# EAGLE design spbka (EAGLE 9.6.2)
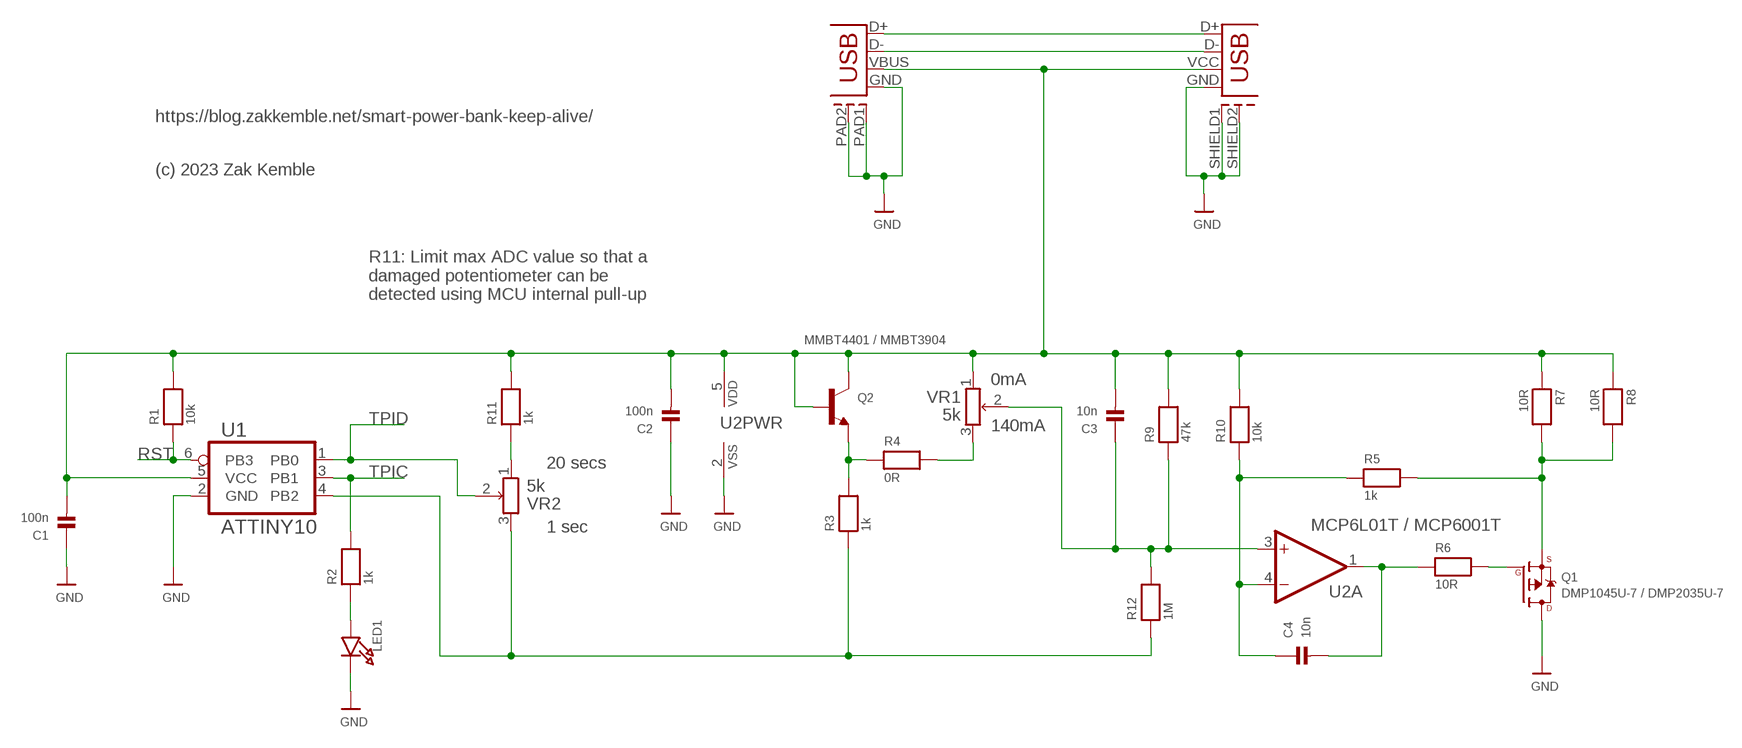
[diagram p0: schematic, sheet 1]

## Parts
C1  100n  CAP_CERAMIC0402_XSMALL  [0402_XSMALL]
C2  100n  CAP_CERAMIC0402_XSMALL  [0402_XSMALL]
C3  10n  CAP_CERAMIC0402_XSMALL  [0402_XSMALL]
C4  10n  CAP_CERAMIC0402_XSMALL  [0402_XSMALL]
LED1  LED0603_NOOUTLINE  [CHIPLED_0603_NOOUTLINE]
Q1  DMP1045U-7 / DMP2035U-7  MOSFET-PSOT-23-WIDE  [SOT-23-WIDE]
Q2  MMBT4401 / MMBT3904  TRANSISTOR_NPN  [SOT23-R]
R1  10k  RESISTOR0402_XSMALL  [0402_XSMALL]
R2  1k  RESISTOR0402_XSMALL  [0402_XSMALL]
R3  1k  RESISTOR0402_XSMALL  [0402_XSMALL]
R4  0R  RESISTOR0402_XSMALL  [0402_XSMALL]
R5  1k  RESISTOR0402_XSMALL  [0402_XSMALL]
R6  10R  RESISTOR0402_XSMALL  [0402_XSMALL]
R7  10R  RESISTOR0402_XSMALL  [0402_XSMALL]
R8  10R  RESISTOR0402_XSMALL  [0402_XSMALL]
R9  47k  RESISTOR0402_XSMALL  [0402_XSMALL]
R10  10k  RESISTOR0402_XSMALL  [0402_XSMALL]
R11  1k  RESISTOR0402_XSMALL  [0402_XSMALL]
R12  1M  RESISTOR0402_XSMALL  [0402_XSMALL]
U1  ATTINY10  ATTINY10SM_PAD  [SOT23-6_SM_PAD]
U2  MCP6L01T / MCP6001T  OPAMP_SINGLECONFIG1_SMPAD  [SOT23-5_SM_PAD]
USB1  USB-TYPE-AHORZ  [USB-TYPE-A]
USB2  USB-PLUG  [USB-TYPE-A-PLUG-SLOT]
VR1  5k  POTENTIOMETERBOURNS3MM  [TRIMPOT_BOURNS3MM]
VR2  5k  POTENTIOMETERBOURNS3MM  [TRIMPOT_BOURNS3MM]

## Nets
GND: C1.1 C2.1 LED1.C Q1.3(D) U1.2(GND) U2.2(PWR:VSS) USB1.GND USB1.SHIELD1(SHEILD1) USB1.SHIELD2(SHEILD2) USB2.GND USB2.PAD1(SHEILD1) USB2.PAD2(SHEILD2)
N$1: Q2.2(E) R3.2 R4.1
N$2: Q1.2(S) R5.2 R7.2 R8.2
N$3: C4.2 R6.1 U2.1(A:OUT)
N$4: LED1.A R2.1
N$5: USB1.D+ USB2.D+
N$6: USB1.D- USB2.D-
N$7: R3.1 R12.1 U1.4(PB2) VR2.3(1E)
N$8: C4.1 R5.1 R10.1 U2.4(A:-IN)
N$9: R4.2 VR1.3(1E)
N$10: Q1.1(G) R6.2
N$11: C3.1 R9.1 R12.2 U2.3(A:+IN) VR1.2(1S)
N$12: R11.1 VR2.1(1A)
RST: R1.1 U1.6(PB3)
TPIC: R2.2 U1.3(PB1)
TPID: U1.1(PB0) VR2.2(1S)
VBUS: C1.2 C2.2 C3.2 Q2.1(B) Q2.3(C) R1.2 R7.1 R8.1 R9.2 R10.2 R11.2 U1.5(VCC) U2.5(PWR:VDD) USB1.VCC(VBUS) USB2.VBUS VR1.1(1A)

## Notes on the sheet
- https://blog.zakkemble.net/smart-power-bank-keep-alive/
- (c) 2023 Zak Kemble
- R11: Limit max ADC value so that a
  damaged potentiometer can be
  detected using MCU internal pull-up
- 0mA
- 140mA
- 20 secs
- 1 sec

## Library data of the parts
C1-C4 = zak:CAP_CERAMIC
LED1 = microbuilder:LED: LED 0603 - 0603 Surface Mount Package 2mA: Green LED - Low Power (3.9mcd, 2ma, 1.7Vf) - Digikey: 475-2709-2-ND Orange LED - Low Power (9.8mcd, 2ma, 1.8Vf) - Digikey: 475-1194-2-ND Red LED - Low Power (5mcd, 2ma, 1.8Vf) - Digikey: 475-1195-2-ND Yellow LED - Low Power (7mcd, 2ma, 1.8Vf) - Digikey: 475-1196-2-ND 5mA: Blue LED - Low Power (17mcd, 5ma, 2.9Vf) - Digikey: LNJ937W8CRACT-ND 0805 - 0805 Surface Mount Package 2mA: Red LED (8.8mcd, 2mA, 1.8Vf, Clear) - Low Power [Digikey: 475-2510-1-ND] Green LED (5mcd, 2mA, 1.8Vf, Clear) - Low Power [Digikey: 475-2730-1-ND] Yellow LED (11.3mcd, 2mA, 1.8Vf, Clear) - Low Power [Digikey: 475-2555-1-ND] 20mA: Red LED (104mcd, 20mA, Diffused) - LS R976 [Digikey: 475-1278-6-ND] Red LED (12mcd, 20mA, 2.0Vf, Clear) - APT2012EC [Digikey: 754-1128-1-ND] Green LED (15mcd, 20mA, 2.2Vf, Clear) - APT2012GC [Digikey: 754-1131-1-ND] Orange LED (160mcd, 20mA, 2.1Vf, Clear) - APT2012SECK [Digikey: 754-1130-1-ND] 1206 - 1206 Surface Mount Package Green LED (26mcd, 20mA, Diffused) - LG N971 [Digikey: 475-1407-6-ND] Red LED (15mcd, 20mA, Diffused) - LH N974 [Digikey: 475-1416-6-ND]
Q1 = zak:MOSFET-P
Q2 = microbuilder:TRANSISTOR_NPN: NPN Transistor Transistor (NPN) 500mA 45V - BC817 [Digikey: 568-1631-1-ND] Transistor (NPN) 500mA 45V - BC817,215 [Mouser: 771-BC817-T/R] SOT23-R - SOT23 footprint optimised for use with solder paste and reflow ovens. SOT23-W - SOT23 footprint optimised for hand-soldering (larger pads).
R1-R12 = zak:RESISTOR
U1 = zak:ATTINY10
U2 = zak:OPAMP_SINGLE
USB1 = zak:USB-TYPE-A
USB2 = zak:USB-PLUG
VR1 VR2 = zak:POTENTIOMETER

## Board
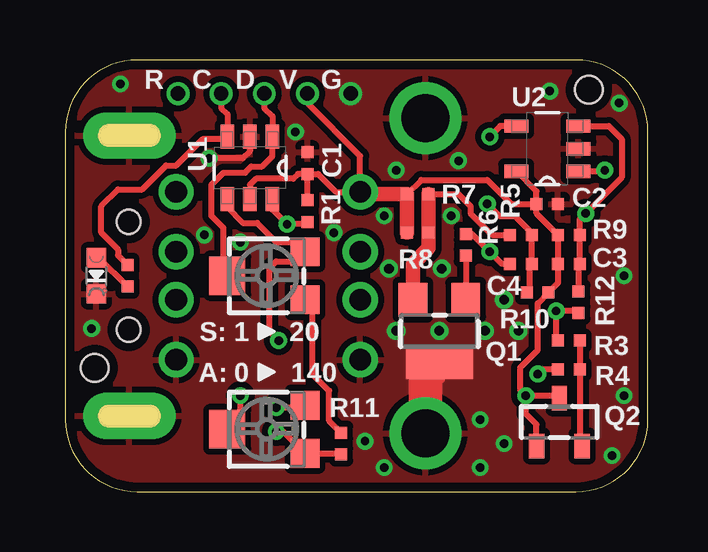
[diagram p1: board, top side]
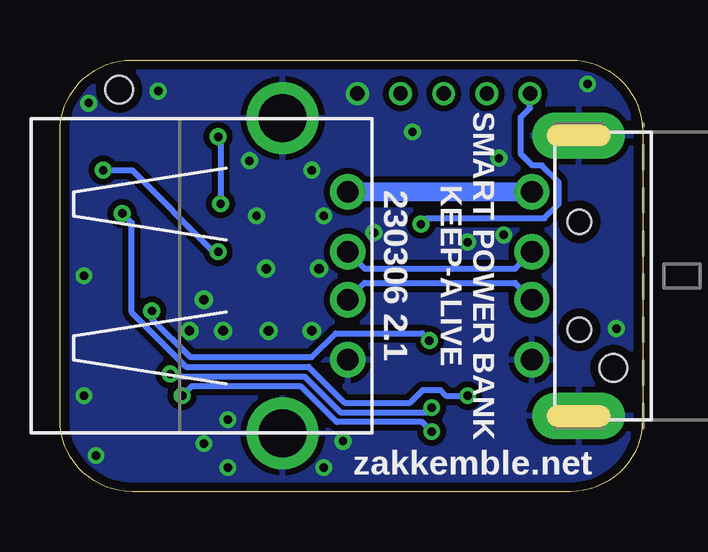
[diagram p2: board, bottom side, seen from below]

Size 24.3 x 18 mm. Coordinates in mm from the lower left corner, seen from the top.
Outline: 0,15 0,3 arc90 3,0 21.3,0 arc90 24.3,3 24.3,15 arc90 21.3,18 3,18 arc90 0,15
Copper layers (1*16): Top 0.0356mm / dielectric 1.5011mm / Bottom 0.0356mm
Design rules "LaenPCBOrder *": minimum track width 6mil, minimum drill 13mil, track to track 6mil, track to pad 6mil, pad to pad 6mil, via to via 6mil, smd to smd 6mil, copper to edge 15mil, drill to drill 6mil, minimum pad ring 11mil, minimum via ring 7mil, stop-mask expansion 2.5mil, vias tented up to drill 20mil, thermal gap 10mil
Holes 1.15 mm at 1.22,5.15 21.83,16.77

### Footprints (pad centres in the part's own frame; a part is rotated, then mirrored left to right if it is on the bottom)
0402_XSMALL = smd 0.5 x 0.5: 1 -0.45,0; 2 0.45,0
CHIPLED_0603_NOOUTLINE = smd 0.8 x 0.8: A 0,-0.75; C 0,0.75
SOT-23-WIDE = smd 1.2 x 1.4: 1 -1.1,-1.3; 2 1.1,-1.3 | smd 2.8 x 1.4: 3 0,1.3
SOT23-R = smd 0.635 x 1.016: 1 -0.95,-1; 2 0.95,-1; 3 0,1
SOT23-6_SM_PAD = smd 1 x 0.56: 1 -1.295,0.94; 2 -1.295,0; 3 -1.295,-0.94; 4 1.295,-0.94; 5 1.295,0; 6 1.295,0.94
SOT23-5_SM_PAD = smd 1 x 0.56: 1 -1.295,0.94; 2 -1.295,0; 3 -1.295,-0.94; 4 1.295,-0.94; 5 1.295,0.94
USB-TYPE-A = drill 0.9: D+ 1,0; D- -1,0; GND 3.5,0; VCC -3.5,0 | drill 2: SHIELD1 -6.57,-2.71; SHIELD2 6.57,-2.71
USB-TYPE-A-PLUG-SLOT = drill 0.9: D+ -1,10.325; D- 1,10.325; GND -3.5,10.325; VBUS 3.5,10.325 | drill 0.9 pad 1.93 long: PAD1 -5.85,8.375; PAD2 5.85,8.375 | hole 1: -2.25,8.345; 2.25,8.345
TRIMPOT_BOURNS3MM = smd 1.2 x 1.2: 1 -1,-1.6; 3 1,-1.6 | smd 1.6 x 1.5: 2 0,1.65

### Placement (x,y rotation side)
C1  10.1,13.7 270 top
C2  20.1,12 180 top
C3  21,9.5 180 top
C4  19,9.5 180 top
LED1  1.3,9 180 top
Q1  15.6,6.7 180 top
Q2  20.6,2.9 0 top
R1  10.1,11.7 90 top
R2  2.6,9 90 top
R3  21,6.3 0 top
R4  21,5.1 180 top
R5  19,10.7 180 top
R6  16.7,10.3 270 top
R7  14.7,12.4 0 top
R8  14.7,10.8 0 top
R9  21,10.7 180 top
R10  19.7,8.3 0 top
R11  11.5,2 270 top
R12  21.4,7.9 90 top
U1  7.7,13.5 270 top
U2  20.1,14.3 180 top
USB1  12.3,9 270 bottom
USB2  -5.7,9 90 bottom
VR1  8.4,2.6 90 top
VR2  8.4,9 90 top

### Tracks (layer width: path | path; a pad name or v marks a point on that pad's centre or on a via)
GND  (via drill 0.35, 0.4, 0.6)
  Top 0.25: U1.2 7.7,14.2 7.4,13.9 v6,13.9
  Top 1.4: USB1.SHIELD2 15.01,4.81 Q1.3
  other vias: 11.9,16.6 18.3,8 18.9,6.7 15.6,6.7 13.5,9.3 15.7,9.3 17.5,6.7 13.8,6.7 17.3,3 18.3,2 17.3,1 13.3,1 12.5,2.1 13.3,11.5 16.1,11.5 13.8,13.4 7.3,10.4 11.2,10.8 23.1,16.2 20.2,16.7 16.4,13.8 9.6,15 1.1,6.8 2.3,17 22.8,1.5 5.8,10.7 23.3,4 23.3,9
  pour Top (isolate 0.25, rank 6): 0,0 0,18 24.3,18 24.3,0
  pour Bottom (isolate 0.25, rank 6): 0,0 0,18 24.3,18 24.3,0
  pour Top (isolate 0.25, rank 5, no thermals): 17.3,6.4 17.3,4.4 13.9,4.4 13.9,6.4
N$1
  Top 0.25: R3.2 R4.1 21.45,2 Q2.2
N$2
  Top 0.25: R5.2 17.8,10.7 16.9,11.6 16.9,11.9 16.4,12.4 R7.2
  Top 0.6: Q1.2 14.5,9.5 15.15,10.15 R8.2 R7.2
N$3  (via drill 0.35)
  Top 0.25: v22.5,13.4 22.46,13.36 U2.1 | R6.1 16.95,10.75 v17.7,10 18.2,9.5 C4.2
  Bottom 0.25: v22.5,13.4 21.3,13.4 17.9,10 v17.7,10
N$4
  Top 0.25: R2.1 1.4,9.75 LED1.A
N$5
  Bottom 0.25: USB2.D+ 5.33,8.7 11.6,8.7 USB1.D+
N$6
  Bottom 0.25: USB1.D- 11.6,9.3 5.33,9.3 USB2.D-
N$7  (via drill 0.35)
  Top 0.25: U1.4 6.76,11.84 7.4,11.2 8,11.2 8.8,10.4 9.5,10.4 9.9,10 VR2.3 9.6,9.6 8.8,9.6 8.5,9.3 8.5,6.7 v8.9,6.3 | R3.1 20.47,6.38 v20.47,7.53 21.32,7.53 R12.1
  Bottom 0.25: v20.47,7.53 20.47,7.21 18.87,5.6 13.8,5.6 12.8,6.6 9.2,6.6 v8.9,6.3
N$8  (via drill 0.35)
  Top 0.25: U2.4 18.14,15.24 v17.7,14.8 | R10.1 19.35,8.4 19.35,9.4 C4.1 R5.1 19.5,10.75 18.75,11.5 18.1,11.5 v17.6,12
  Bottom 0.25: v17.7,14.8 17.6,14.7 v17.6,12
N$9  (via drill 0.35)
  Top 0.25: VR1.3 9.9,3.5 v8.8,3.5 | R4.2 19.9,5.1 v19.7,4.9
  Bottom 0.25: v8.8,3.5 9,3.3 12.6,3.3 14.1,4.8 19.6,4.8 v19.7,4.9
N$10
  Top 0.25: Q1.1 16.3,8 16.7,8.4 R6.2
N$11  (via drill 0.35)
  Top 0.25: v7.3,4 7.3,3.15 VR1.2 | R12.2 21.4,9.45 C3.1 R9.1 21.45,11.35 v21.7,11.6 23.2,13.1 23.2,14.7 22.66,15.24 U2.3
  Bottom 0.25: v21.7,11.6 21.3,11.2 21.3,7.47 19.03,5.2 13.93,5.2 12.43,3.7 9.7,3.7 9.17,4.23 8.43,4.23 8.2,4 v7.3,4
N$12
  Top 0.25: R11.1 11,2.95 11,4.2 10.3,4.9 10.3,7.7 VR2.1
RST  (via drill 0.35, 0.6)
  Top 0.25: U1.6 8.64,11.76 v9.25,11.15 10,11.15 R1.1
  Bottom 0.25: v9.25,11.15 9,11.4 4.1,11.4 3.5,12 3.5,12.9 4.2,13.6 4.6,13.6 5.1,14.1 5.1,15.6 4.7,16 v4.7,16.6
TPIC  (via drill 0.6)
  Top 0.25: R2.2 2.2,9.85 2.2,10.1 1.5,10.8 1.5,11.9 2.2,12.6 3.2,12.6 4.2,13.6 4.63,13.6 5.73,14.7 6.66,14.7 U1.3 6.76,15.74 6.5,16 v6.5,16.6
TPID  (via drill 0.6)
  Top 0.25: VR2.2 6.6,9 6.6,11 6.1,11.5 6.1,12.8 6.6,13.3 7.5,13.3 7.75,13.55 8.2,13.55 8.64,13.99 U1.1 8.64,15.66 8.3,16 v8.3,16.6
VBUS  (via drill 0.35, 0.6)
  Top 0.25: v8.8,2.5 9.1,2.5 VR1.1 11.45,1.6 R11.2 | C2.2 19.65,12.52 U2.5 | C2.2 18.6,12 17.6,13 14.85,13 R7.1 | C2.2 19.65,11.6 R9.2 C3.2 20.55,8.7 R10.2 19.7,7.85 19.7,5.9 18.97,5.17 18.97,4.24 v19.2,4.01 v19.2,4 | Q2.3 20.5,4 v19.2,4 | Q2.1 19.65,2.8 19.2,3.25 v19.2,4 | C1.2 9.7,13.25 9.5,13.05 7.95,13.05 7.7,12.8 U1.5 | R1.2 C1.2 | C1.2 10.55,13.25 11.3,12.5 USB1.VCC 12.3,14 10.1,16.2 v10.1,16.6
  Top 0.6: USB1.VCC 12.4,12.4 R7.1 R8.1
  Bottom 0.25: v8.8,2.5 9.2,2.9 12.77,2.9 14.27,4.4 18.8,4.4 v19.2,4
  Bottom 0.8: USB2.VBUS USB1.VCC

### Text on the board
tPlace: R | C | D | V | G | S: | 1 | 20 | A: | 0 | 140
bPlace: SMART POWER BANK / KEEP-ALIVE | 230306 2.1 | zakkemble.net
Milling: Plated slot x2